# EAGLE design RGB_Controller (EAGLE 9.6.2)
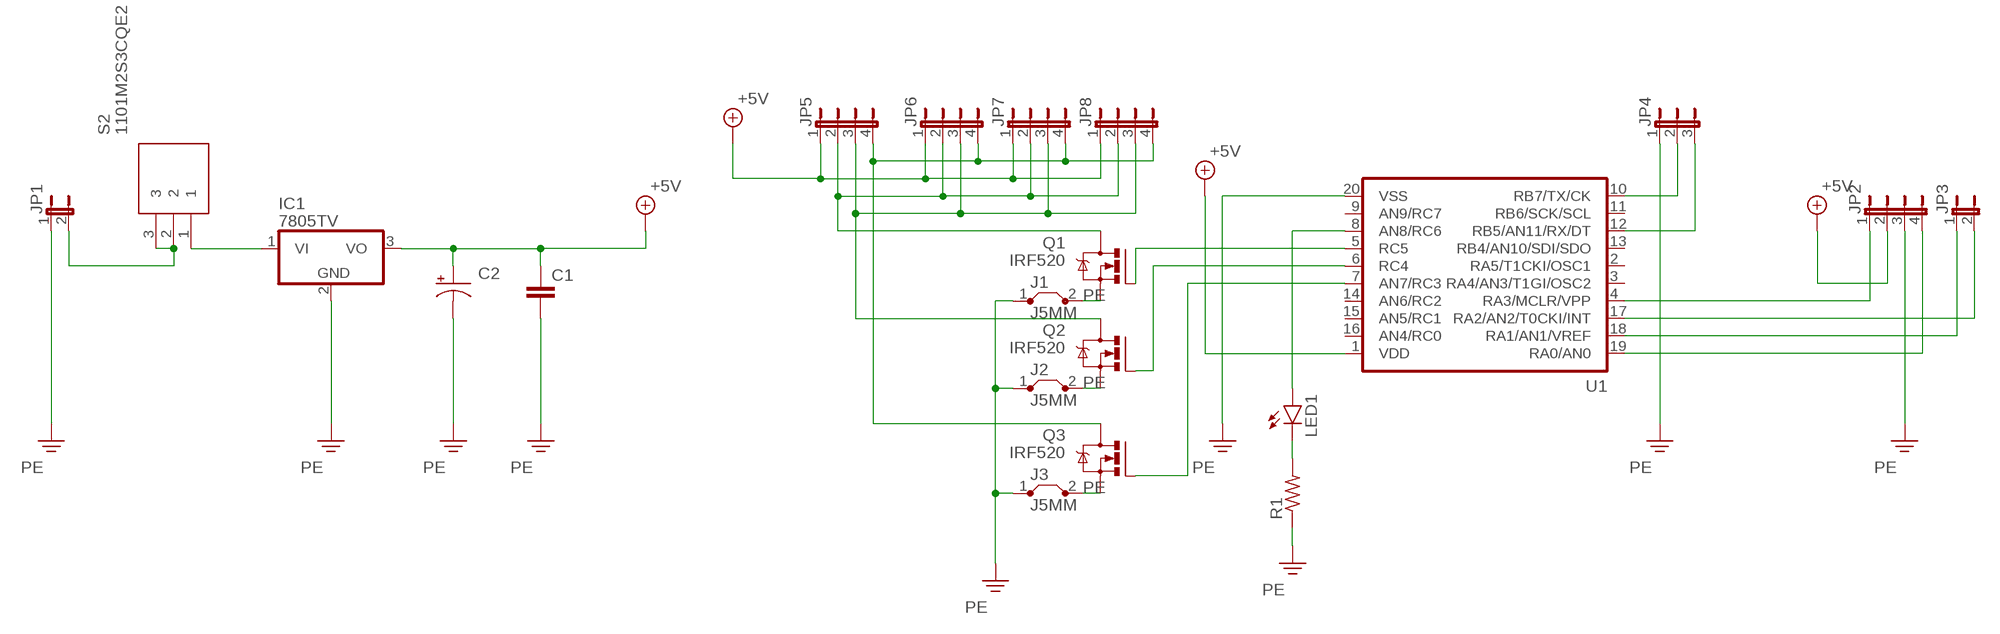
[diagram p0: schematic, sheet 1]

## Parts
C1  C-EU025-024X044  [C025-024X044]
C2  CPOL-USE3.5-10  [E3,5-10]
IC1  7805TV  [TO220V]
J1  J5MM  [05]
J2  J5MM  [05]
J3  J5MM  [05]
JP1  JP1E  [JP1]
JP2  JP4E  [JP4]
JP3  JP1E  [JP1]
JP4  JP2E  [JP2]
JP5  JP4E  [JP4]
JP6  JP4E  [JP4]
JP7  JP4E  [JP4]
JP8  JP4E  [JP4]
LED1  LED5MM  [LED5MM]
Q1  IRF520  [TO220BV]
Q2  IRF520  [TO220BV]
Q3  IRF520  [TO220BV]
R1  R-US_0207/10  [0207/10]
S2  1101M2S3CQE2  [1000-SERIES(SPDT)]
U1  PIC16F6XX  [DIL20]

## Nets
+5V: C1.1 C2.+ IC1.3(VO) JP2.2 JP5.1 JP6.1 JP7.1 JP8.1 U1.1(VDD)
N$1: JP1.2 S2.2 S2.3
N$2: JP2.1 U1.4(RA3/MCLR/VPP)
N$3: LED1.K(C) R1.2
N$4: JP2.4 U1.19(RA0/AN0)
N$5: JP3.1 U1.18(RA1/AN1/VREF)
N$6: JP3.2 U1.17(RA2/AN2/T0CKI/INT)
N$7: JP4.2 U1.10(RB7/TX/CK)
N$8: JP4.3 U1.12(RB5/AN11/RX/DT)
N$9: Q1.G U1.5(RC5)
N$10: Q2.G U1.6(RC4)
N$11: Q3.G U1.7(AN7/RC3)
N$12: JP5.2 JP6.2 JP7.2 JP8.2 Q1.D
N$13: JP5.3 JP6.3 JP7.3 JP8.3 Q2.D
N$14: JP5.4 JP6.4 JP7.4 JP8.4 Q3.D
N$15: LED1.A U1.8(AN8/RC6)
N$16: IC1.1(VI) S2.1
PE: C1.2 C2.- IC1.2(GND) J1.1 J1.2 J2.1 J2.2 J3.1 J3.2 JP1.1 JP2.3 JP4.1 Q1.S Q2.S Q3.S R1.1 U1.20(VSS)
Unconnected: U1.2(RA5/T1CKI/OSC1) U1.3(RA4/AN3/T1GI/OSC2) U1.9(AN9/RC7) U1.11(RB6/SCK/SCL) U1.13(RB4/AN10/SDI/SDO) U1.14(AN6/RC2) U1.15(AN5/RC1) U1.16(AN4/RC0)

## Library data of the parts
C1 = rcl:C-EU: CAPACITOR, European symbol; SPICEPREFIX: C
C2 = rcl:CPOL-US: POLARIZED CAPACITOR, American symbol; SPICEPREFIX: C
IC1 = linear:78*: Positive VOLTAGE REGULATOR Source: http://cache.national.com/ds/LM/LM78L05.pdf http://www.fairchildsemi.com/ds/LM/LM7805.pdf
J1-J3 = jumper:J: Bridge
JP1 JP3 = jumper:JP1E: JUMPER
JP2 JP5-JP8 = jumper:JP4E: JUMPER
JP4 = jumper:JP2E: JUMPER
LED1 = led:LED: LED OSRAM: - CHIPLED LG R971, LG N971, LY N971, LG Q971, LY Q971, LO R971, LY R971 LH N974, LH R974 LS Q976, LO Q976, LY Q976 LO Q996 - Hyper CHIPLED LW Q18S LB Q993, LB Q99A, LB R99A - SideLED LS A670, LO A670, LY A670, LG A670, LP A670 LB A673, LV A673, LT A673, LW A673 LH A674 LY A675 LS A676, LA A676, LO A676, LY A676, LW A676 LS A679, LY A679, LG A679 - Hyper Micro SIDELED® LS Y876, LA Y876, LO Y876, LY Y876 LT Y87S - SmartLED LW L88C, LW L88S LB L89C, LB L89S, LG L890 LS L89K, LO L89K, LY L89K LS L896, LA L896, LO L896, LY L896 - TOPLED LS T670, LO T670, LY T670, LG T670, LP T670 LSG T670, LSP T670, LSY T670, LOP T670, LYG T670 LG T671, LOG T671, LSG T671 LB T673, LV T673, LT T673, LW T673 LH T674 LS T676, LA T676, LO T676, LY T676, LB T676, LH T676, LSB T676, LW T676 LB T67C, LV T67C, LT T67C, LS T67K, LO T67K, LY T67K, LW E67C LS E67B, LA E67B, LO E67B, LY E67B, LB E67C, LV E67C, LT E67C LW T67C LS T679, LY T679, LG T679 LS T770, LO T770, LY T770, LG T770, LP T770 LB T773, LV T773, LT T773, LW T773 LH T774 LS E675, LA E675, LY E675, LS T675 LS T776, LA T776, LO T776, LY T776, LB T776 LHGB T686 LT T68C, LB T68C - Hyper Mini TOPLED® LB M676 - Mini TOPLED Santana® LG M470 LS M47K, LO M47K, LY M47K Source: http://www.osram.convergy.de LUXEON: - LUMILED® LXK2-PW12-R00, LXK2-PW12-S00, LXK2-PW14-U00, LXK2-PW14-V00 LXK2-PM12-R00, LXK2-PM12-S00, LXK2-PM14-U00 LXK2-PE12-Q00, LXK2-PE12-R00, LXK2-PE12-S00, LXK2-PE14-T00, LXK2-PE14-U00 LXK2-PB12-K00, LXK2-PB12-L00, LXK2-PB12-M00, LXK2-PB14-N00, LXK2-PB14-P00, LXK2-PB14-Q00 LXK2-PR12-L00, LXK2-PR12-M00, LXK2-PR14-Q00, LXK2-PR14-R00 LXK2-PD12-Q00, LXK2-PD12-R00, LXK2-PD12-S00 LXK2-PH12-R00, LXK2-PH12-S00 LXK2-PL12-P00, LXK2-PL12-Q00, LXK2-PL12-R00 Source: www.luxeon.com KINGBRIGHT: KA-3528ASYC Source: www.kingbright.com
Q1-Q3 = transistor-power:IRF520: HEXFET Power MOSFET
R1 = rcl:R-US_: RESISTOR, American symbol; SPICEPREFIX: R
S2 = 1101M2S3CQE2:1101M2S3CQE2: 1101M2S3CQE2 (Slide Switches) Source: Datasheet <https://www.ckswitches.com/media/1429/1000.pdf>; ARROW_PART_NUMBER: 1101M2S3CQE2; ARROW_PRICE-STOCK: https://www.arrow.com/en/products/1101m2s3cqe2/ck?region=nac; DESCRIPTION: 1101M2S3CQE2 (Slide Switches); HEIGHT: mm; MANUFACTURER_NAME: C & K COMPONENTS; MANUFACTURER_PART_NUMBER: 1101M2S3CQE2; MOUSER_PART_NUMBER: 611-1101M2S3CQE2; MOUSER_PRICE-STOCK: https://www.mouser.co.uk/ProductDetail/CK/1101M2S3CQE2?qs=C4UUOezh8MStnZqkTHGAfQ%3D%3D
U1 = pic16f690:PIC16F6XX

## Board
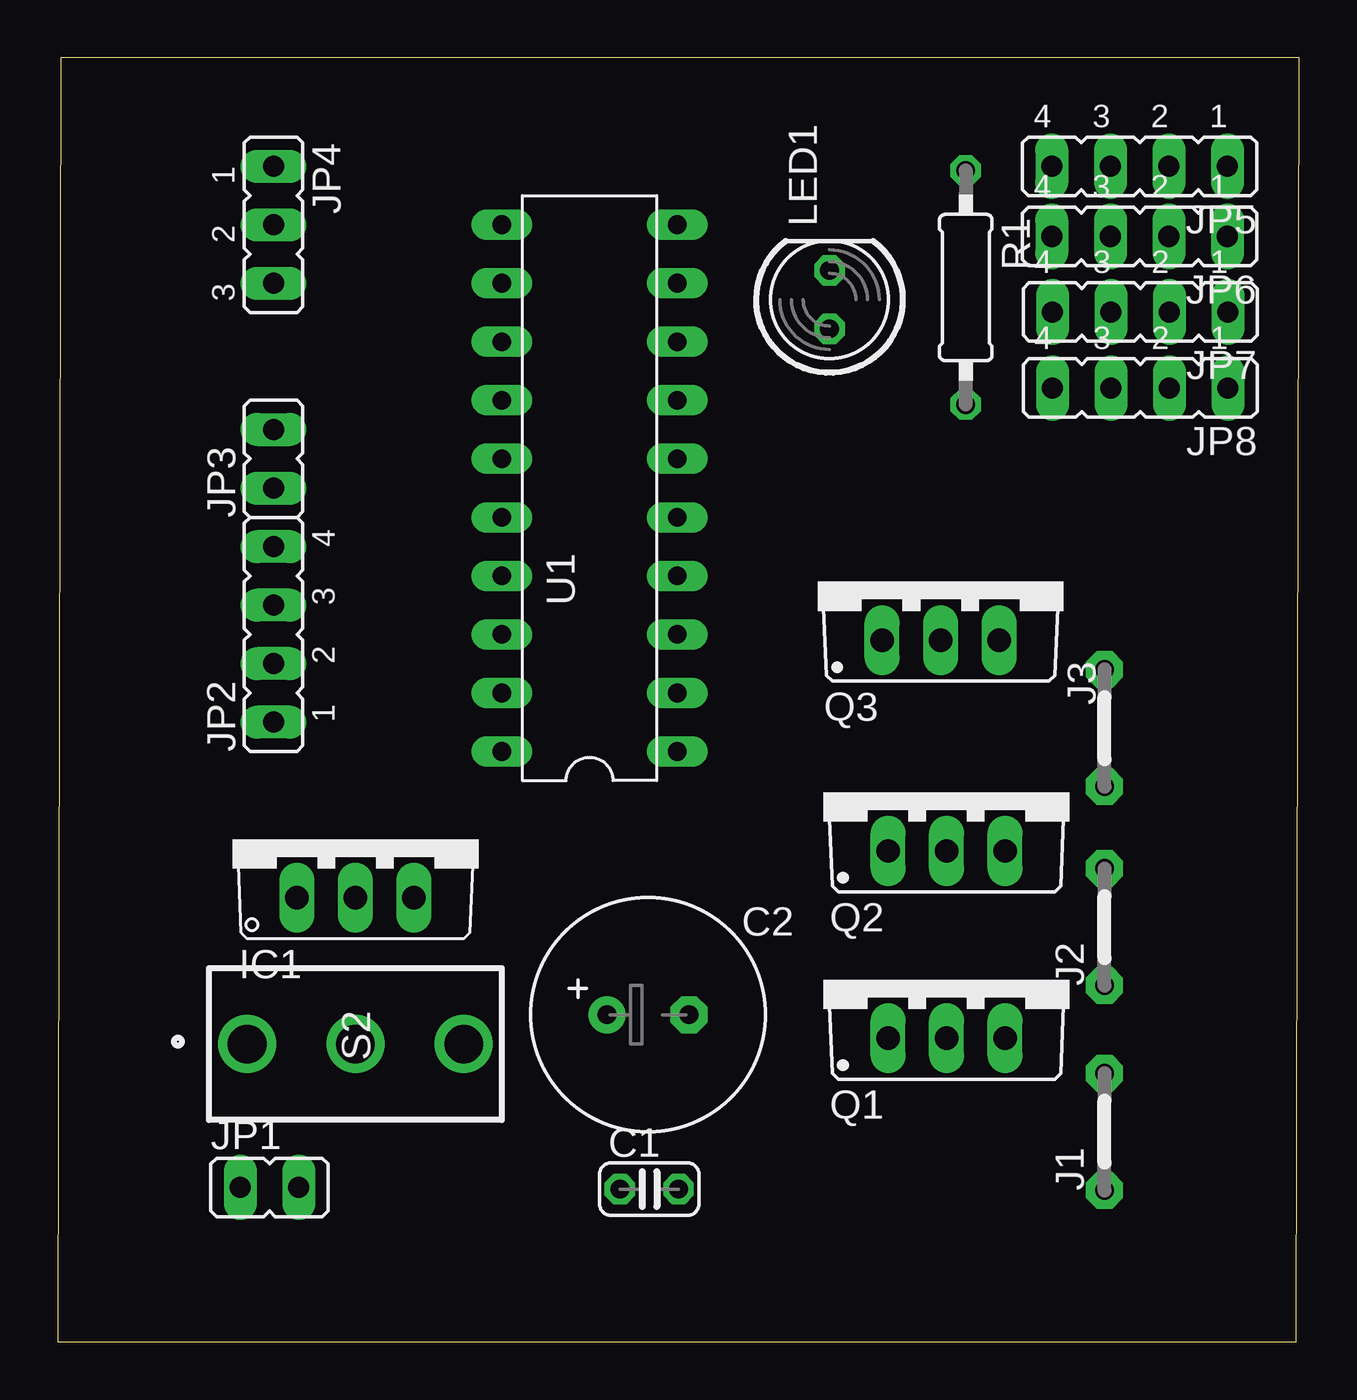
[diagram p1: board, top side]
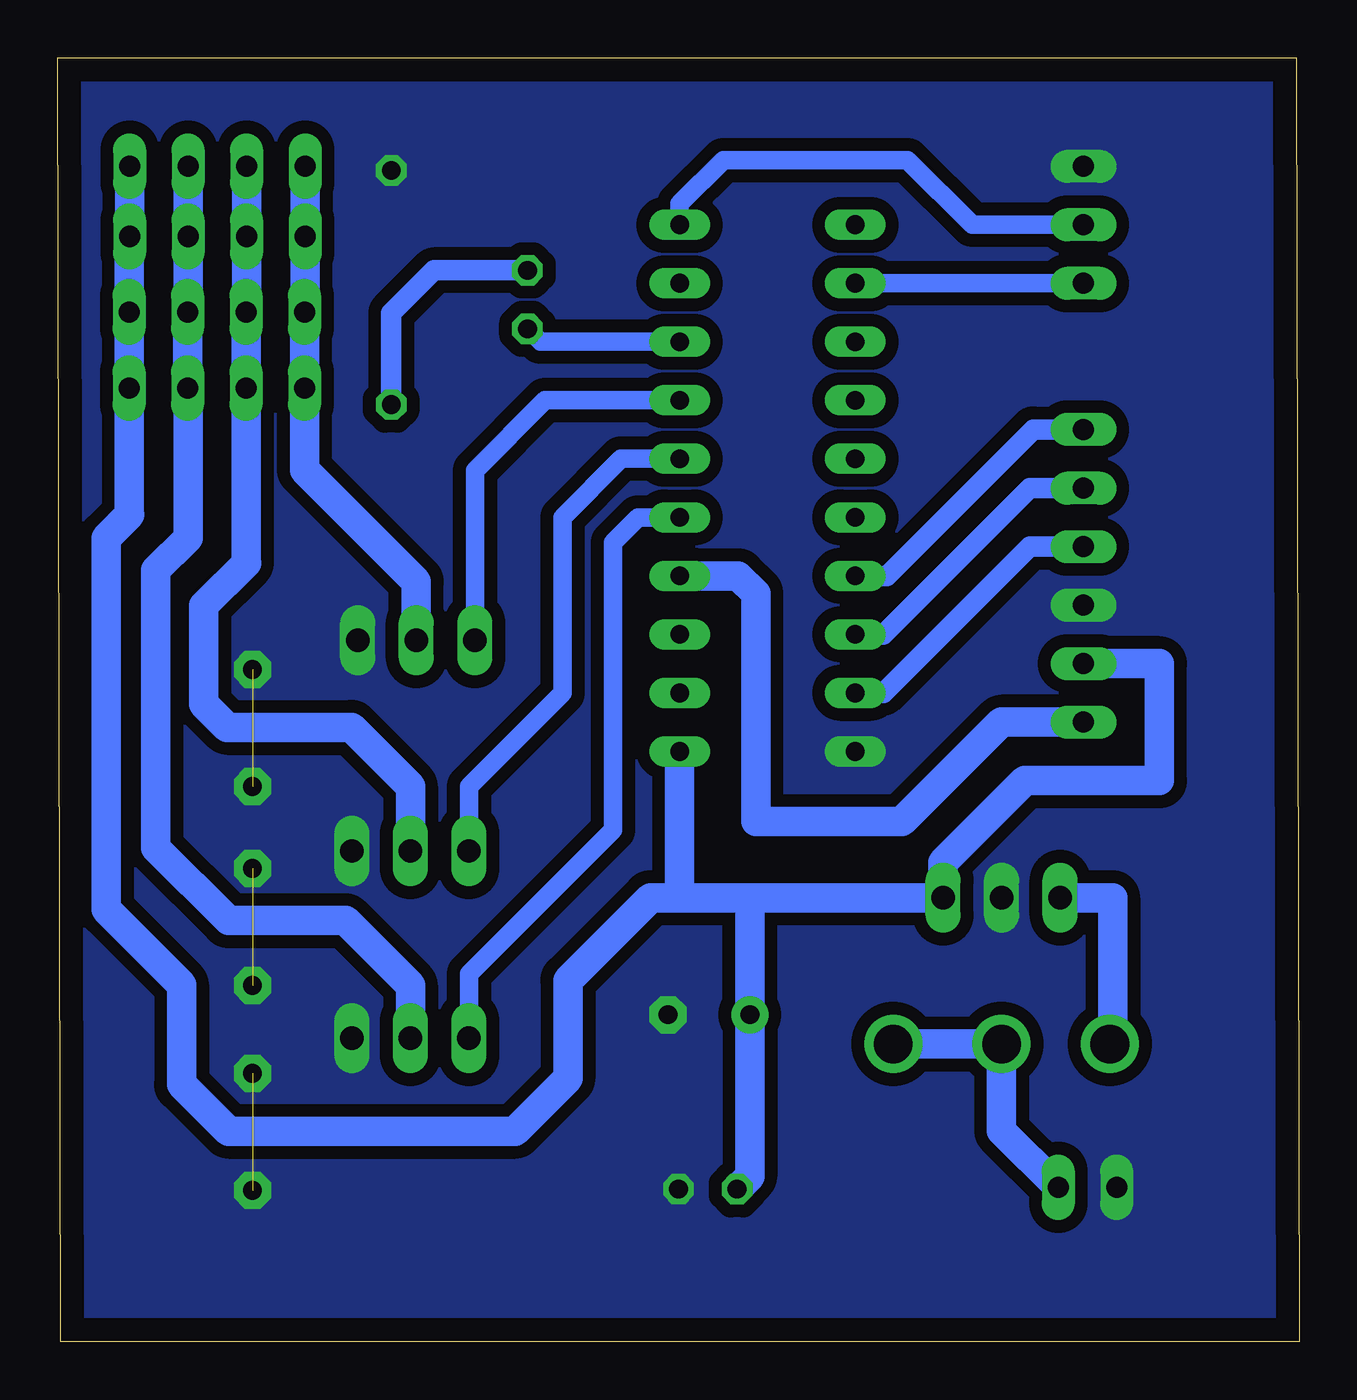
[diagram p2: board, bottom side, seen from below]

Size 53.9 x 55.74 mm. Coordinates in mm from the lower left corner, seen from the top.
Outline: 0,0 53.77,0 53.9,55.74 0.13,55.74 0,0
Copper layers (1*16): Top 0.035mm / dielectric 1.5mm / Bottom 0.035mm
Design rules "default *": minimum track width 6mil, minimum drill 0.35mm, track to track 22mil, track to pad 20mil, pad to pad 20mil, via to via 20mil, smd to smd 6mil, copper to edge 40mil, drill to drill 6mil, minimum pad ring 10mil, minimum via ring 8mil, stop-mask expansion 4mil, vias tented up to drill 0mil, thermal gap 10mil

### Footprints (pad centres in the part's own frame; a part is rotated, then mirrored left to right if it is on the bottom)
C025-024X044 = drill 0.813 octagon: 1 -1.27,0; 2 1.27,0
E3,5-10 = drill 0.813 pad 1.6: + -1.778,0 | drill 0.813 pad 1.6 octagon: - 1.778,0
TO220V = drill 1.016 long: 1 -2.54,-2.54; 2 0,-2.54; 3 2.54,-2.54
05 = drill 0.813 pad 1.6 octagon: 1 -2.54,0; 2 2.54,0
JP1 = drill 0.914 long: 1 0,-1.27; 2 0,1.27
JP4 = drill 0.914 long: 1 -3.81,0; 2 -1.27,0; 3 1.27,0; 4 3.81,0
JP2 = drill 0.914 long: 1 -2.54,0; 2 0,0; 3 2.54,0
LED5MM = drill 0.813 octagon: A -1.27,0; K 1.27,0
TO220BV = drill 1.016 long: D 0,-2.54; G -2.54,-2.54; S 2.54,-2.54
0207/10 = drill 0.813 octagon: 1 -5.08,0; 2 5.08,0
1000-SERIES(SPDT) = drill 1.68 pad 2.48: 1 0,-4.7; 2 0,0; 3 0,4.7
DIL20 = drill 0.813 long: 1 -11.43,-3.81; 2 -8.89,-3.81; 3 -6.35,-3.81; 4 -3.81,-3.81; 5 -1.27,-3.81; 6 1.27,-3.81; 7 3.81,-3.81; 8 6.35,-3.81; 9 8.89,-3.81; 10 11.43,-3.81; 11 11.43,3.81; 12 8.89,3.81; 13 6.35,3.81; 14 3.81,3.81; 15 1.27,3.81; 16 -1.27,3.81; 17 -3.81,3.81; 18 -6.35,3.81; 19 -8.89,3.81; 20 -11.43,3.81

### Placement (x,y rotation side)
C1  25.68,6.63 0 top
C2  25.63,14.2 0 top
IC1  12.93,21.82 0 top
J1  45.44,9.12 90 top
J2  45.44,18.01 90 top
J3  45.44,26.64 90 top
JP1  9.19,6.71 270 top
JP2  9.37,30.71 90 top
JP3  9.37,38.33 0 top
JP4  9.37,48.49 270 top
JP5  46.96,51.03 180 top
JP6  46.96,47.98 180 top
JP7  46.99,44.7 180 top
JP8  46.99,41.4 180 top
LED1  33.5,45.24 90 top
Q1  38.58,15.72 0 top
Q2  38.58,23.85 0 top
Q3  38.33,32.99 0 top
R1  39.42,45.76 270 top
S2  12.93,12.93 270 top
U1  23.09,37.06 90 top

### Tracks (layer width: path | path; a pad name or v marks a point on that pad's centre or on a via)
+5V
  Bottom 1.27: C1.1 23.85,7.19 C2.+ 23.85,19.28 | U1.1 26.9,19.28 | 23.85,19.28 26.9,19.28 | 23.85,19.28 IC1.3 15.47,20.8 11.91,24.36 6.07,24.36 6.07,29.44 JP2.2 | 26.9,19.28 28.17,19.28 31.75,15.7 31.75,11.43 34.04,9.14 46.48,9.14 48.51,11.18 48.51,15.49 51.79,18.77 51.79,34.9 50.77,35.92 50.8,35.94 JP8.1 JP7.1 50.8,47.95 JP6.1 JP5.1
N$1
  Bottom 1.27: S2.3 S2.2 12.93,9.17 JP1.2
N$2
  Bottom 1.27: JP2.1 12.93,26.9 17.25,22.58 23.6,22.58 23.6,32.49 24.36,33.25 U1.4
N$3
  Bottom 0.889: LED1.K 37.57,46.51 39.42,44.66 R1.2
N$4
  Bottom 0.889: JP2.4 11.71,34.52 18.06,28.17 U1.19
N$5
  Bottom 0.889: JP3.1 11.71,37.06 18.06,30.71 U1.18
N$6
  Bottom 0.889: JP3.2 11.56,39.6 17.91,33.25 U1.17
N$7
  Bottom 0.813: U1.10 26.9,49.39 24.99,51.3 17.01,51.3 14.2,48.49 JP4.2
N$8
  Bottom 0.813: U1.12 JP4.3
N$9
  Bottom 0.813: U1.5 28.7,35.79 29.79,34.7 29.79,22.23 36.04,15.98 Q1.G
N$10
  Bottom 0.813: U1.6 29.44,38.33 31.98,35.79 31.98,28.17 36.04,24.11 Q2.G
N$11
  Bottom 0.813: U1.7 32.74,40.87 35.79,37.82 Q3.G
N$12
  Bottom 1.27: Q1.D 38.58,15.47 41.4,18.29 46.48,18.29 49.63,21.44 49.63,33.5 48.23,34.9 48.23,41.38 JP8.2 JP7.2 48.23,44.73 JP6.2 JP5.2
N$13
  Bottom 1.27: Q2.D 38.58,24.11 41.15,26.67 46.53,26.67 47.55,27.69 47.55,31.95 45.7,33.81 45.72,33.83 JP8.3 JP7.3 45.7,44.73 JP6.3 JP5.3
N$14
  Bottom 1.27: Q3.D 38.33,32.99 43.18,37.85 JP8.4 JP7.4 43.16,44.73 JP6.4 JP5.4
N$15
  Bottom 0.813: U1.8 32.94,43.41 LED1.A
N$16
  Bottom 1.27: IC1.1 8.1,19.28 8.1,13.06 S2.1
PE  (3 unrouted)
  pour Bottom (no thermals): 0,0.26 0,55.5 53.85,55.5 54.12,0